# Altium schematic sheet Buzzer.SchDoc
size A4; SheetNumber: 10; SheetTotal: 11
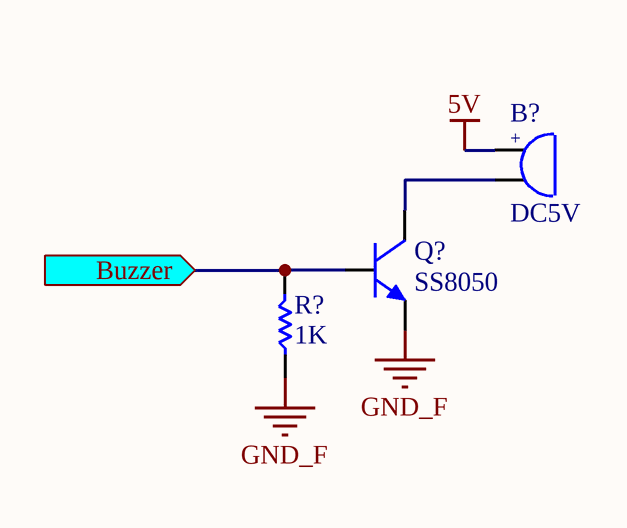
[diagram p0: Buzzer.SchDoc]

## Parts
B?  DC5V  [Buzzer 5x9x5.5]
Q?  SS8050  [SOT23-3N]
R?  1K  [R 0805]

## Ports
Buzzer (in)

## Nets
5V: B?.A
GND_F: Q?.2(E) R?.1
Buzzer: Q?.1(B) R?.2 ; port Buzzer
NetB?_K: B?.K Q?.3(C)

## Notes on the sheet
- (in symbol Buzzer) +

## Library data of the parts
B? = Buzzer: Active Piezo Electronic Buzzer Beep; BOM名称: 蜂鸣器; 版权归属: 源创客; 学习资源: www.ooocke.com
Q? = 8050-SMD: High frequency amplification-NPN; BOM名称: 高频放大-NPN型; 版权归属: 源创客; 属性: 40V 1.5A 1W 100MHZ; 学习资源: www.ooocke.com
R? = R: Chip resistor; 版权归属: 源创客; BOM名称: Chip resistor; 学习资源: www.ooocke.com